# EAGLE design main_1 (EAGLE 7.6.0)
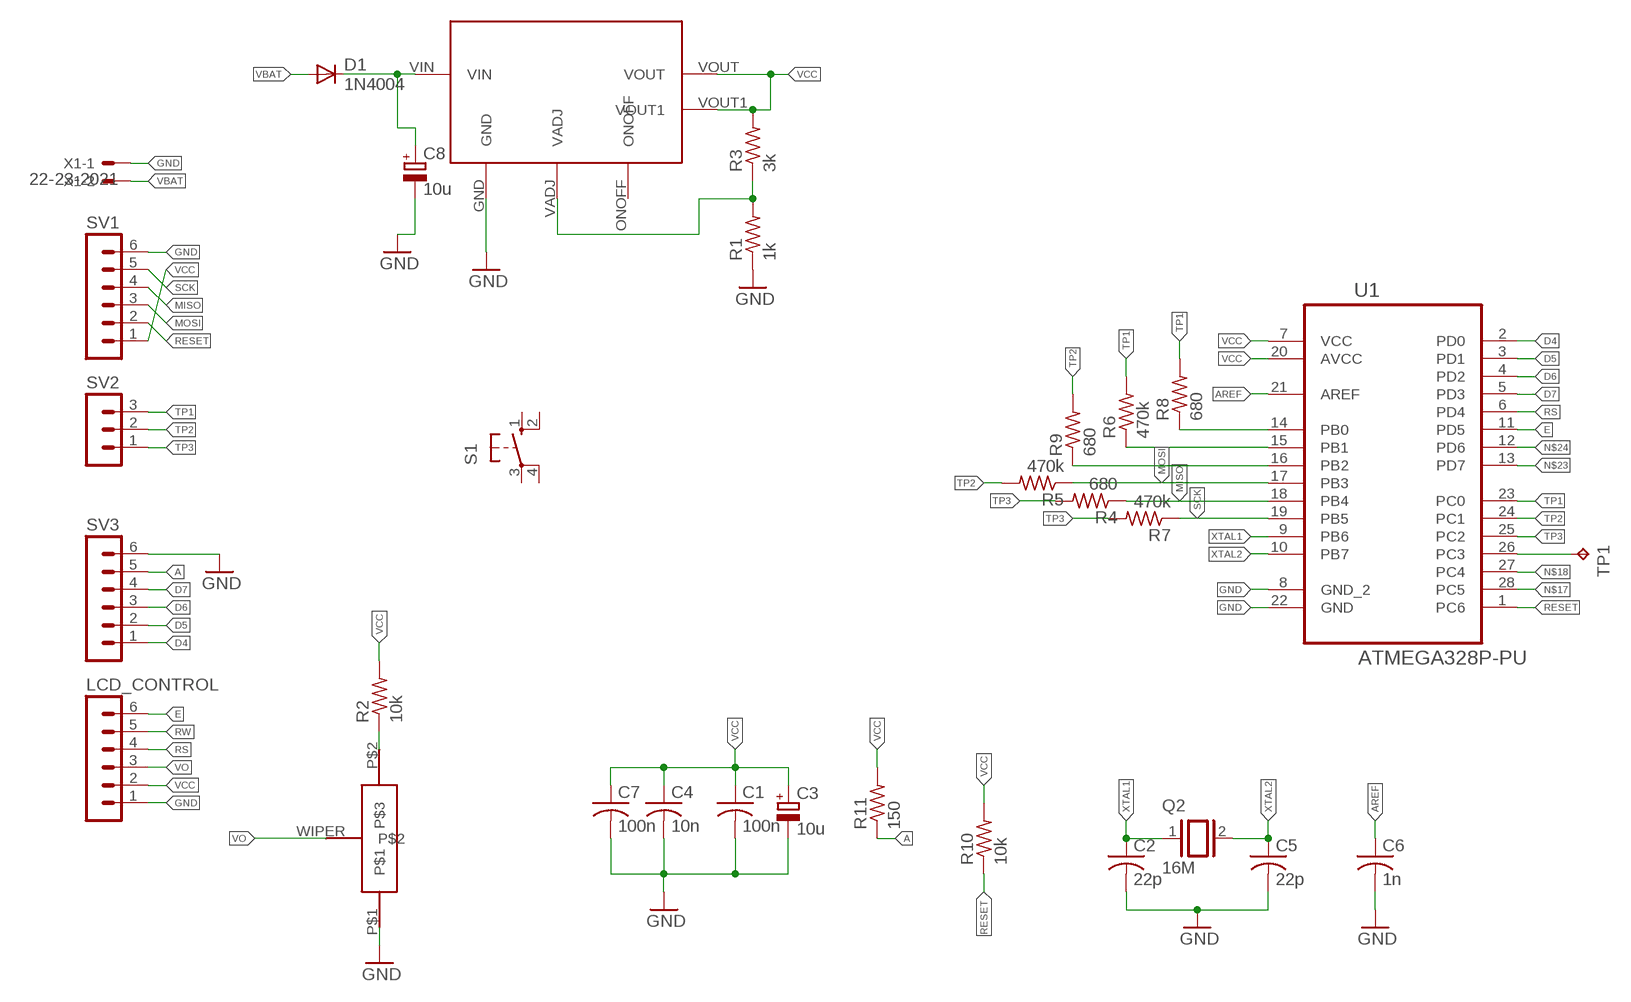
[diagram p0: schematic, sheet 1]

## Parts
C1  100n  C-US050-025X075  [C050-025X075]
C2  22p  C-US025-025X050  [C025-025X050]
C3  10u  CPOL-EUE2.5-6  [E2,5-6]
C4  10n  C-US050-025X075  [C050-025X075]
C5  22p  C-US025-025X050  [C025-025X050]
C6  1n  C-US050-025X075  [C050-025X075]
C7  100n  C-US050-025X075  [C050-025X075]
C8  10u  CPOL-EUE2.5-6  [E2,5-6]
D1  1N4004  [DO41-10]
LCD_CONTROL  MA06-1  [MA06-1]
Q2  16M  XTAL/S  [QS]
R1  1k  R-US_0207/10  [0207/10]
R2  10k  R-US_0207/10  [0207/10]
R3  3k  R-US_0207/10  [0207/10]
R4  680  R-US_0207/10  [0207/10]
R5  470k  R-US_0207/10  [0207/10]
R6  470k  R-US_0207/10  [0207/10]
R7  470k  R-US_0207/10  [0207/10]
R8  680  R-US_0207/10  [0207/10]
R9  680  R-US_0207/10  [0207/10]
R10  10k  R-US_0207/10  [0207/10]
R11  150  R-US_0207/12  [0207/12]
S1  10-XX  [B3F-10XX]
SV1  MA06-1  [MA06-1]
SV2  MA03-1  [MA03-1]
SV3  MA06-1  [MA06-1]
TP1  TPTP20SQ  [TP20SQ]
U1  ATMEGA328P-PU  [DIP254P762X457-28]
U$1  POTAR  [POTAR]
U$2  NJM2389  [DPACK-5]
X1  22-23-2021  [22-23-2021]

## Nets
+5V1: C8.+ D1.C U$2.VIN
A: R11.1 SV3.5
AREF: C6.1 U1.21(AREF)
D4: SV3.1 U1.2(PD0)
D5: SV3.2 U1.3(PD1)
D6: SV3.3 U1.4(PD2)
D7: SV3.4 U1.5(PD3)
E: LCD_CONTROL.6 U1.11(PD5)
GND: C1.2 C2.2 C3.- C4.2 C5.2 C6.2 C7.2 C8.- LCD_CONTROL.1 R1.1 SV1.6 SV3.6 U1.8(GND_2) U1.22(GND) U$1.P$1 U$2.GND X1.1
MISO: R4.1 SV1.4 U1.18(PB4)
MOSI: R5.1 SV1.3 U1.17(PB3)
N$1: R2.1 U$1.P$2
N$2: TP1.TP U1.26(PC3)
N$3: R1.2 R3.1 U$2.VADJ
N$6: R8.1 U1.14(PB0)
N$7: R6.1 U1.15(PB1)
N$8: R9.1 U1.16(PB2)
N$17: U1.28(PC5)
N$18: U1.27(PC4)
N$23: U1.13(PD7)
N$24: U1.12(PD6)
RESET: R10.1 SV1.2 U1.1(PC6)
RS: LCD_CONTROL.4 U1.6(PD4)
RW: LCD_CONTROL.5
SCK: R7.1 SV1.5 U1.19(PB5)
TP1: R6.2 R8.2 SV2.3 U1.23(PC0)
TP2: R5.2 R9.2 SV2.2 U1.24(PC1)
TP3: R4.2 R7.2 SV2.1 U1.25(PC2)
VBAT: D1.A X1.2
VCC: C1.1 C3.+ C4.1 C7.1 LCD_CONTROL.2 R2.2 R3.2 R10.2 R11.2 SV1.1 U1.7(VCC) U1.20(AVCC) U$2.VOUT U$2.VOUT1
VO: LCD_CONTROL.3 U$1.WIPER
XTAL1: C2.1 Q2.1 U1.9(PB6)
XTAL2: C5.1 Q2.2 U1.10(PB7)
Unconnected: S1.1(S) S1.2(S1) S1.3(P) S1.4(P1) U$2.ONOFF

## Library data of the parts
C1 C2 C4-C7 = adafruit:C-US: CAPACITOR, American symbol
C3 C8 = rcl:CPOL-EU: POLARIZED CAPACITOR, European symbol
D1 = adafruit:1N4004: DIODE General purpose 1N400x type rectifier (With bigger pads) http://www.ladyada.net/library/pcb/eaglelibrary.html
LCD_CONTROL SV1 SV3 = con-lstb:MA06-1: PIN HEADER; OC_FARNELL: unknown; OC_NEWARK: unknown
Q2 = special:XTAL/S: CRYSTAL
R1-R11 = adafruit:R-US_: RESISTOR, American symbol
S1 = switch-omron:10-XX: OMRON SWITCH; MPN: B3F-1000; OC_FARNELL: 176432; OC_NEWARK: 36M3542
SV2 = con-lstb:MA03-1: PIN HEADER; OC_FARNELL: unknown; OC_NEWARK: unknown
TP1 = testpad:TP: Test pad
U1 = Atmel_By_element14_Batch_1-00:ATMEGA328P-PU: 8-bit Microcontroller with In-System Programmable Flash; MPN: ATMEGA328P-PU; OC_FARNELL: 1715487; OC_NEWARK: 15R0268; PACKAGE: PDIP-28; SUPPLIER: Atmel
U$1 = 7_segment_lib:POTAR
U$2 = 7_segment_lib:NJM2389
X1 = con-molex:22-23-2021: .100" (2.54mm) Center Header - 2 Pin; MF: MOLEX; MPN: 22-23-2021; OC_FARNELL: 1462926; OC_NEWARK: 25C3832

## Board
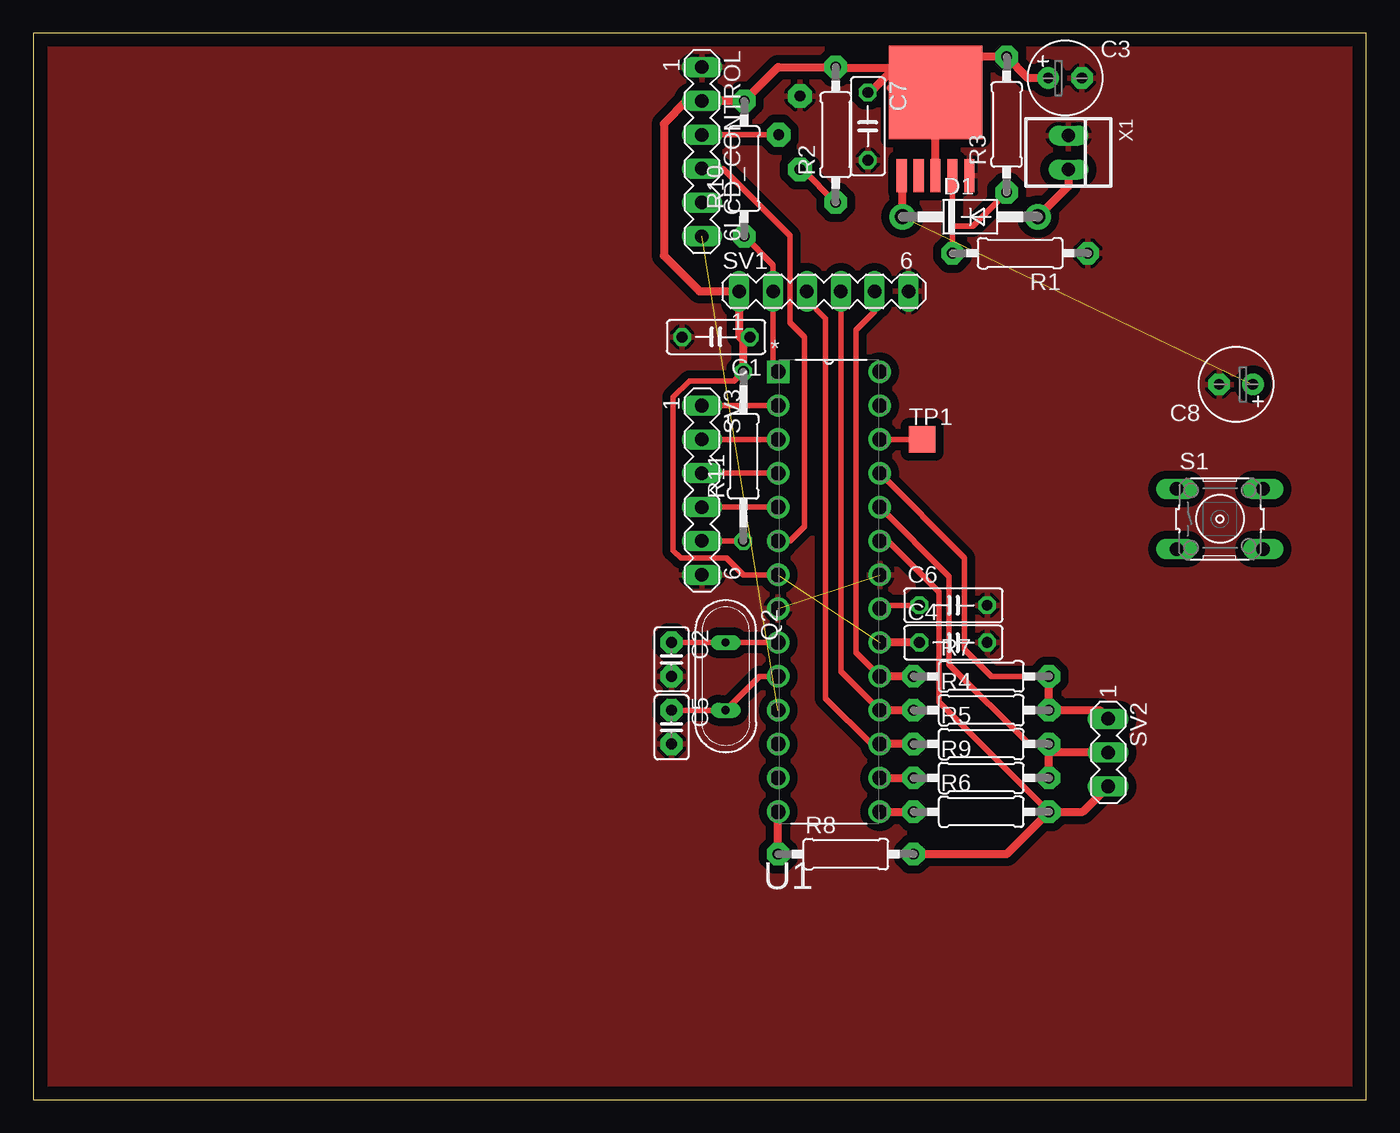
[diagram p1: board, top side]
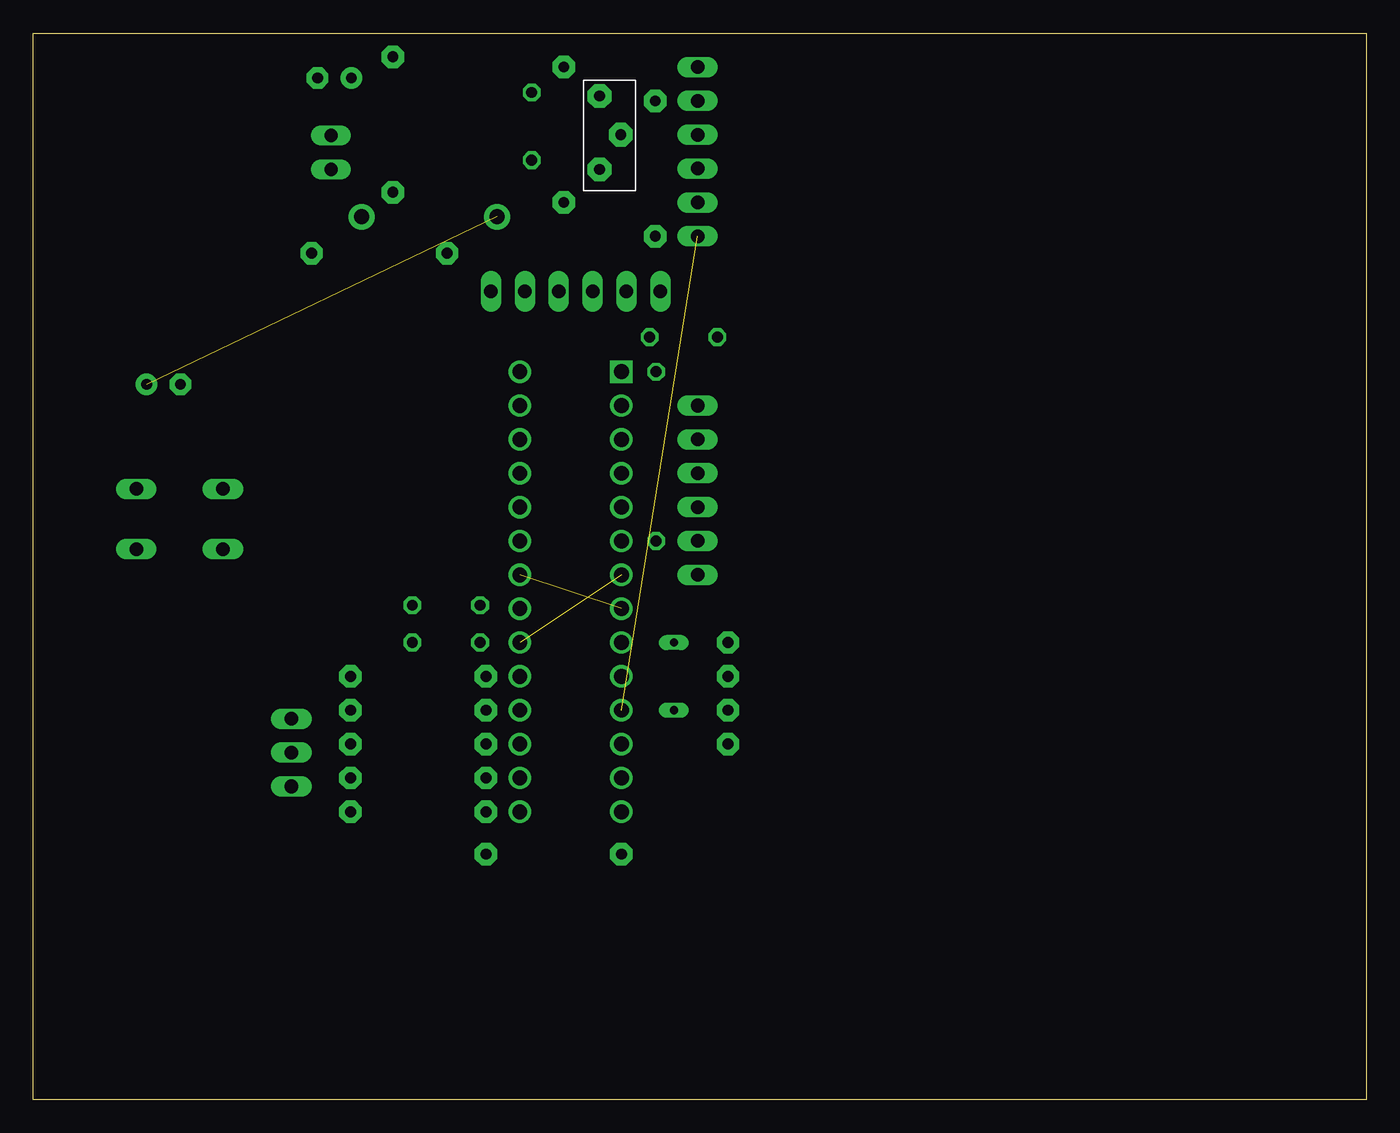
[diagram p2: board, bottom side, seen from below]

Size 100 x 80 mm. Coordinates in mm from the lower left corner, seen from the top.
Outline: 0,0 100,0 100,80 0,80 0,0
Copper layers (1*16): Top 0.035mm / dielectric 1.5mm / Bottom 0.035mm
Design rules "default": minimum track width 10mil, minimum drill 24mil, track to track 8mil, track to pad 8mil, pad to pad 8mil, via to via 8mil, smd to smd 8mil, copper to edge 40mil, drill to drill 8mil, minimum pad ring 10mil, minimum via ring 8mil, stop-mask expansion 4mil, vias tented up to drill 0mil, thermal gap 10mil

### Footprints (pad centres in the part's own frame; a part is rotated, then mirrored left to right if it is on the bottom)
C050-025X075 = drill 0.813 octagon: 1 -2.54,0; 2 2.54,0
C025-025X050 = drill 0.813 pad 1.676 octagon: 1 -1.27,0; 2 1.27,0
E2,5-6 = drill 0.813 pad 1.6: + -1.27,0 | drill 0.813 pad 1.6 octagon: - 1.27,0
DO41-10 = drill 1.118 pad 1.93: A 5.08,0; C -5.08,0
MA06-1 = drill 1.016 long: 1 -6.35,0; 2 -3.81,0; 3 -1.27,0; 4 1.27,0; 5 3.81,0; 6 6.35,0
QS = drill 0.61 long: 1 -2.54,0; 2 2.54,0
0207/10 = drill 0.813 pad 1.676 octagon: 1 -5.08,0; 2 5.08,0
0207/12 = drill 0.813 octagon: 1 -6.35,0; 2 6.35,0
B3F-10XX = drill 1.016 long: 1 -3.251,2.261; 2 3.251,2.261; 3 -3.251,-2.261; 4 3.251,-2.261
MA03-1 = drill 1.016 long: 1 -2.54,0; 2 0,0; 3 2.54,0
TP20SQ = smd 2 x 2: TP 0,0
DIP254P762X457-28 = drill 1.118 square: 1 -7.62,33.02 | drill 1.118: 2 -7.62,30.48; 3 -7.62,27.94; 4 -7.62,25.4; 5 -7.62,22.86; 6 -7.62,20.32; 7 -7.62,17.78; 8 -7.62,15.24; 9 -7.62,12.7; 10 -7.62,10.16; 11 -7.62,7.62; 12 -7.62,5.08; 13 -7.62,2.54; 14 -7.62,0; 15 0,0; 16 0,2.54; 17 0,5.08; 18 0,7.62; 19 0,10.16; 20 0,12.7; 21 0,15.24; 22 0,17.78; 23 0,20.32; 24 0,22.86; 25 0,25.4; 26 0,27.94; 27 0,30.48; 28 0,33.02
POTAR = drill 0.8 pad 1.778 octagon: P$1 -2.9,-0.5; P$2 2.6,-0.5; WIPER 0,1.1
DPACK-5 = smd 0.76 x 2.5: GND 2.54,-2.75; ONOFF -1.27,-2.75; VADJ 1.27,-2.75; VIN -2.54,-2.75; VOUT1 0,-2.75 | smd 7 x 7: VOUT 0,3.5
22-23-2021 = drill 1 long: 1 -1.27,0; 2 1.27,0

### Placement (x,y rotation side)
C1  51.22,57.21 180 top
C2  47.88,33.02 270 top
C3  77.41,76.64 0 top
C4  69.02,34.29 0 top
C5  47.88,27.94 270 top
C6  69.02,37.08 0 top
C7  62.61,73.03 270 top
C8  90.23,53.66 180 top
D1  70.29,66.23 0 top
LCD_CONTROL  50.16,71.12 270 top
Q2  51.94,31.75 270 top
R1  74.04,63.5 180 top
R2  60.2,72.39 90 top
R3  73.03,73.15 90 top
R4  71.12,29.21 0 top
R5  71.12,26.67 0 top
R6  71.12,21.59 0 top
R7  71.12,31.75 0 top
R8  60.96,18.41 0 top
R9  71.12,24.13 0 top
R10  53.34,69.85 90 top
R11  53.28,48.26 90 top
S1  89.03,43.56 0 top
SV1  59.31,60.64 0 top
SV2  80.64,26.04 270 top
SV3  50.16,45.72 270 top
TP1  66.67,49.53 0 top
U1  63.5,21.59 0 top
U$1  57.02,72.39 270 bottom
U$2  67.69,72.07 0 top
X1  77.66,71.06 270 top

### Tracks (layer width: path | path; a pad name or v marks a point on that pad's centre or on a via)
+5V1  (1 unrouted)
  Top 0.61: D1.C 65.22,69.26 U$2.VIN
A
  Top 0.406: SV3.5 R11.1
AREF
  Top 0.406: U1.21 63.75,37.08 C6.1
D4
  Top 0.406: SV3.1 U1.2
D5
  Top 0.406: U1.3 SV3.2
D6
  Top 0.406: SV3.3 U1.4
D7
  Top 0.406: U1.5 SV3.4
E  (1 unrouted)
GND  (1 unrouted)
  pour Top (isolate 0.61): 1.27,0 99.06,0 99.06,80.01 1.27,80.01
MISO
  Top 0.406: U1.18 60.58,32.13 SV1.4
  Top 0.61: R4.1 U1.18
MOSI
  Top 0.406: U1.17 62.87,26.67 59.44,30.1 59.44,58.61 58.04,60.01 SV1.3
  Top 0.61: R5.1 U1.17
N$1
  Top 0.406: U$1.P$2 57.72,69.79 R2.1
N$2
  Top 0.406: U1.26 TP1.TP
N$3
  Top 0.406: U$2.VADJ 68.96,65.53 | 68.96,65.53 R1.2 | R3.1 70.48,65.53 68.96,65.53
N$6
  Top 0.61: R8.1 U1.14
N$7
  Top 0.61: U1.15 R6.1
N$8
  Top 0.61: U1.16 R9.1
RESET
  Top 0.406: U1.1 55.5,54.99 SV1.2 55.5,62.61 R10.1
RS
  Top 0.406: U1.6 56.77,41.91 57.85,42.99 57.85,57.21 56.77,58.29 56.77,64.83 51.75,69.85 LCD_CONTROL.4
SCK
  Top 0.406: U1.19 61.72,33.53 61.72,57.72 63.12,59.12 SV1.5
  Top 0.61: R7.1 U1.19
TP1
  Top 0.406: U1.23 64.14,41.91 67.94,38.1 67.94,29.84 R6.2
  Top 0.61: R8.2 73.03,18.41 R6.2 78.74,21.59 SV2.3
TP2
  Top 0.406: U1.24 68.71,39.24 68.71,32.64 74.68,26.67 R5.2
  Top 0.61: R9.2 76.2,26.04 | 76.2,26.04 R5.2 | SV2.2 76.2,26.04
TP3
  Top 0.406: U1.25 69.85,40.64 69.85,33.78 71.88,31.75 R7.2
  Top 0.61: R7.2 R4.2 80.01,29.21 SV2.1
VBAT
  Top 0.61: X1.2 77.66,68.52 D1.A
VCC  (1 unrouted)
  Top 0.406: U1.7 53.28,39.37 52.01,40.64 48.58,40.64 48.01,41.21 48.01,52.7 49.21,53.91 52.58,53.91 R11.2
  Top 0.61: C4.1 U1.20 | LCD_CONTROL.2 R10.2 | R10.2 55.88,77.47 R2.2 60.26,77.41 64.64,77.41 | 64.64,77.41 66.55,77.41 67.69,76.26 | 67.69,76.26 U$2.VOUT | 64.33,75.89 U$2.VOUT | U$2.VOUT1 U$2.VOUT | 67.69,76.26 69.66,78.23 R3.2 74.61,76.64 C3.+ | C7.1 62.8,75.56 64.64,77.41 | R10.2 49.02,74.93 47.31,73.22 47.31,63.31 49.97,60.64 SV1.1 52.96,57.28 53.39,56.84 | R11.2 53.28,56.73 53.39,56.84 | 53.39,56.84 C1.1
VO
  Top 0.406: LCD_CONTROL.3 U$1.WIPER
XTAL1
  Top 0.406: U1.9 Q2.1 C2.1
XTAL2
  Top 0.406: U1.10 54.48,31.75 Q2.2 C5.1